# Altium project PCB_Project.PrjPcb (part 2 of 2)

## Sheet lcd_ex.SchDoc
size A4
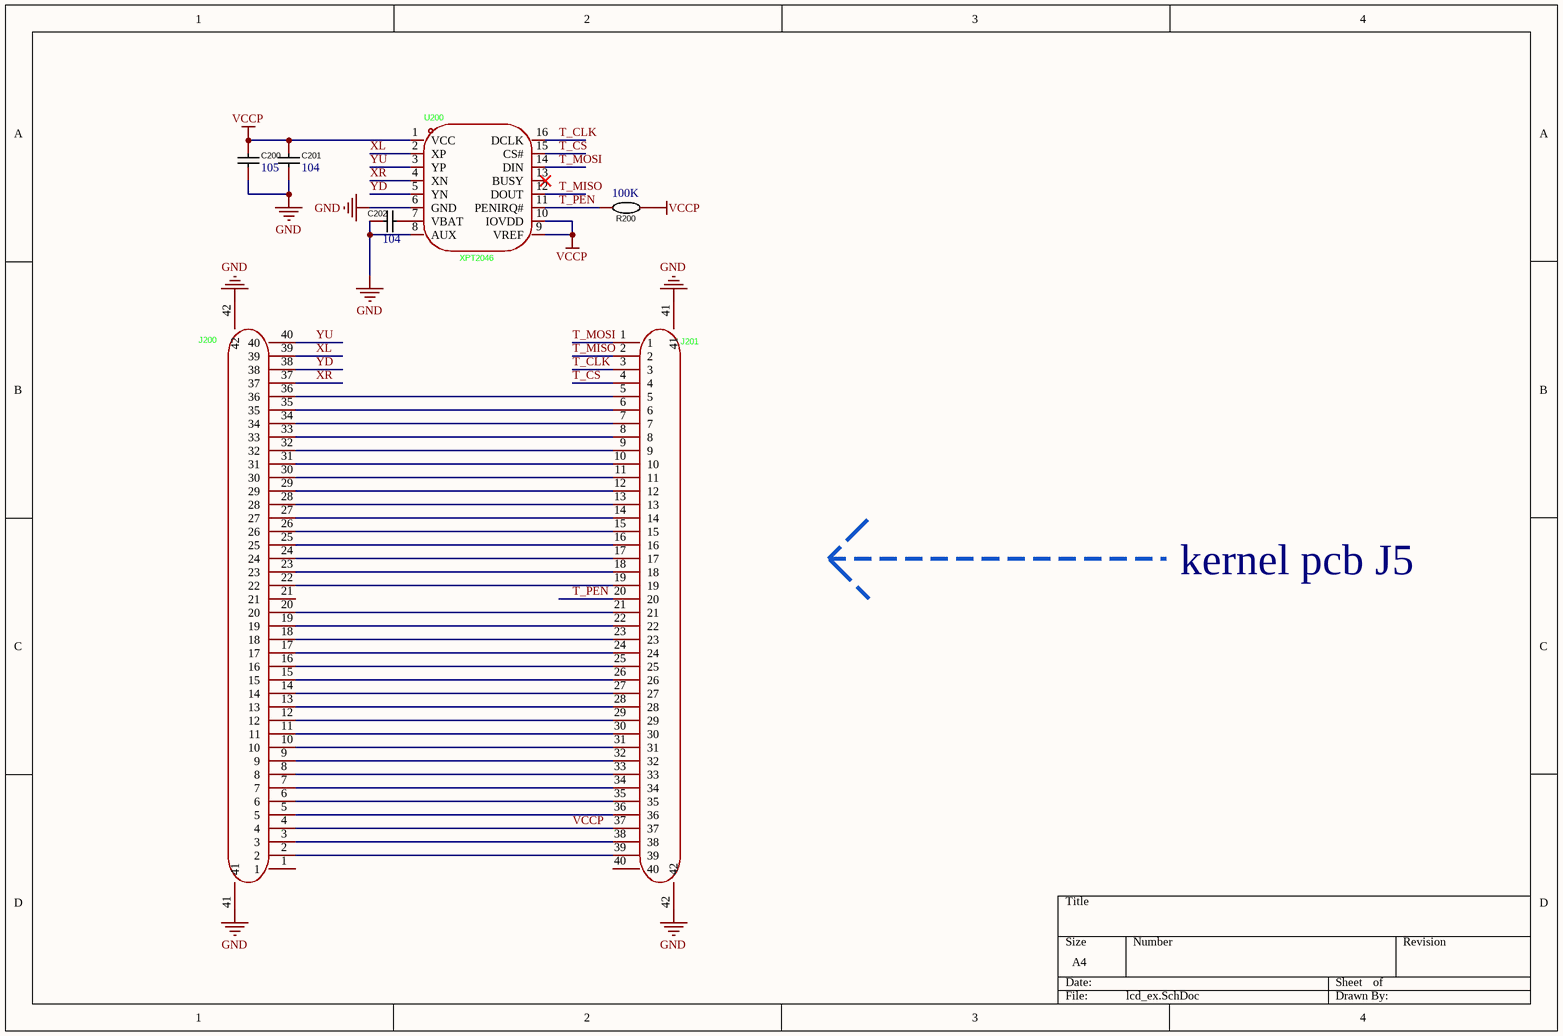
[diagram p5: lcd_ex.SchDoc]

### Parts
C200  105  [0805_C]
C201  104  [0805_C]
C202  104  [0805_C]
J200  AFC01-S40FCA-00  [FPC-SMD_AFC01-S40FCA-00]  (value not drawn)
J201  AFC01-S40FCA-00  [FPC-SMD_AFC01-S40FCA-00]  (value not drawn)
R200  100K  [0805_R]
U200  XPT2046  [TSSOP-16_L5.0-W4.4-P0.65-LS6.4-BL]

### Nets
GND: C200.1 C201.1 C202.2 J200.41 J200.42 J201.41 J201.42 U200.6(GND) U200.8(AUX)
VCCP: C200.2 C201.2 J200.4 J201.37 R200.2 U200.1(VCC) U200.9(VREF) U200.10(IOVDD)
T_CLK: J201.3 U200.16(DCLK)
T_CS: J201.4 U200.15(CS#)
T_MISO: J201.2 U200.12(DOUT)
T_MOSI: J201.1 U200.14(DIN)
T_PEN: J201.20 R200.1 U200.11(PENIRQ#)
XL: J200.39 U200.2(XP)
XR: J200.37 U200.4(XN)
YD: J200.38 U200.5(YN)
YU: J200.40 U200.3(YP)
NetC202_1: C202.1 U200.7(VBAT)
NetJ200_2: J200.2 J201.39
NetJ200_3: J200.3 J201.38
NetJ200_5: J200.5 J201.36
NetJ200_6: J200.6 J201.35
NetJ200_7: J200.7 J201.34
NetJ200_8: J200.8 J201.33
NetJ200_9: J200.9 J201.32
NetJ200_10: J200.10 J201.31
NetJ200_11: J200.11 J201.30
NetJ200_12: J200.12 J201.29
NetJ200_13: J200.13 J201.28
NetJ200_14: J200.14 J201.27
NetJ200_15: J200.15 J201.26
NetJ200_16: J200.16 J201.25
NetJ200_17: J200.17 J201.24
NetJ200_18: J200.18 J201.23
NetJ200_19: J200.19 J201.22
NetJ200_20: J200.20 J201.21
NetJ200_22: J200.22 J201.19
NetJ200_23: J200.23 J201.18
NetJ200_24: J200.24 J201.17
NetJ200_25: J200.25 J201.16
NetJ200_26: J200.26 J201.15
NetJ200_27: J200.27 J201.14
NetJ200_28: J200.28 J201.13
NetJ200_29: J200.29 J201.12
NetJ200_30: J200.30 J201.11
NetJ200_31: J200.31 J201.10
NetJ200_32: J200.32 J201.9
NetJ200_33: J200.33 J201.8
NetJ200_34: J200.34 J201.7
NetJ200_35: J200.35 J201.6
NetJ200_36: J200.36 J201.5

Not connected (* = marked no-connect by the designer): J200 1 21; J201 40; U200 13(BUSY)*

### Notes on the sheet
- kernel pcb J5

### Library data of the parts
C200-C202 = 0402C_104: 电容100nf; Manufacturer: FH(风华); Name: 20pF; Symbol: 0402CG200J500NT; Add into BOM: yes; Value: 20pF; Tolerance: ±5%; Voltage Rated: 50V; Temperature Coefficient: C0G; Device: 0402CG200J500NT; LCSC Part Name: 20pF ±5% 50V; Supplier Part: C1554; Manufacturer Part: 0402CG200J500NT; Supplier Footprint: 0402; JLCPCB Part Class: Basic Part; Datasheet: https://atta.szlcsc.com/upload/public/pdf/source/20170923/C1554_1506149268708988361.pdf; Supplier: LCSC; Convert to PCB: yes
J200 J201 = AFC01-S40FCA-00: FPC; Manufacturer: JS(钜硕电子); Add into BOM: yes; Locking Feature: 翻盖式; Number of Contacts: 40P; Pitch: 0.5mm; FFC, FCB Thickness: 0.3mm; Symbol: AFC01-S40FCA-00; Device: AFC01-S40FCA-00; LCSC Part Name: 间距:0.5mm P数:40P 翻盖式 下接; Supplier Part: C262674; Manufacturer Part: AFC01-S40FCA-00; Supplier Footprint: SMD,P=0.5mm,卧贴; JLCPCB Part Class: Extended Part; Datasheet: https://item.szlcsc.com/datasheet/AFC01-S40FCA-00/253933.html; Supplier: LCSC; Convert to PCB: yes; Contact Type: 下接; Mounting Type: 卧贴; Height Above Board: 2mm
R200 = 0402WGF1003TCE: 电阻100K; Manufacturer: UNI-ROYAL(厚声); Name: 10kΩ; Symbol: 0402WGF1002TCE; Add into BOM: yes; Value: 10kΩ; Tolerance: ±1%; Power(Watts): 62.5mW; Temperature Coefficient: ±100ppm/℃; Overload Voltage (Max): 50V; Device: 0402WGF1002TCE; LCSC Part Name: 10kΩ ±1% 62.5mW; Supplier Part: C25744; Manufacturer Part: 0402WGF1002TCE; Supplier Footprint: 0402; JLCPCB Part Class: Basic Part; Datasheet: https://atta.szlcsc.com/upload/public/pdf/source/20200306/C422600_1E6D84923E4A46A82E41ADD87F860B5C.pdf; Supplier: LCSC; Convert to PCB: yes; Type: 厚膜电阻; Operating Temperature Range: -55℃~+155℃
U200 = XPT2046: Manufacturer: XPT(矽普特); Add into BOM: yes; Symbol: XPT2046; Device: XPT2046; LCSC Part Name: XPT2046; Supplier Part: C19076; Manufacturer Part: XPT2046; Supplier Footprint: TSSOP-16; JLCPCB Part Class: Extended Part; Datasheet: https://item.szlcsc.com/datasheet/XPT2046/19779.html; Supplier: LCSC; Convert to PCB: yes; Touch Screen Type: -; Interface: -

## Sheet lcd_ex_cap_touch.SchDoc
size A4
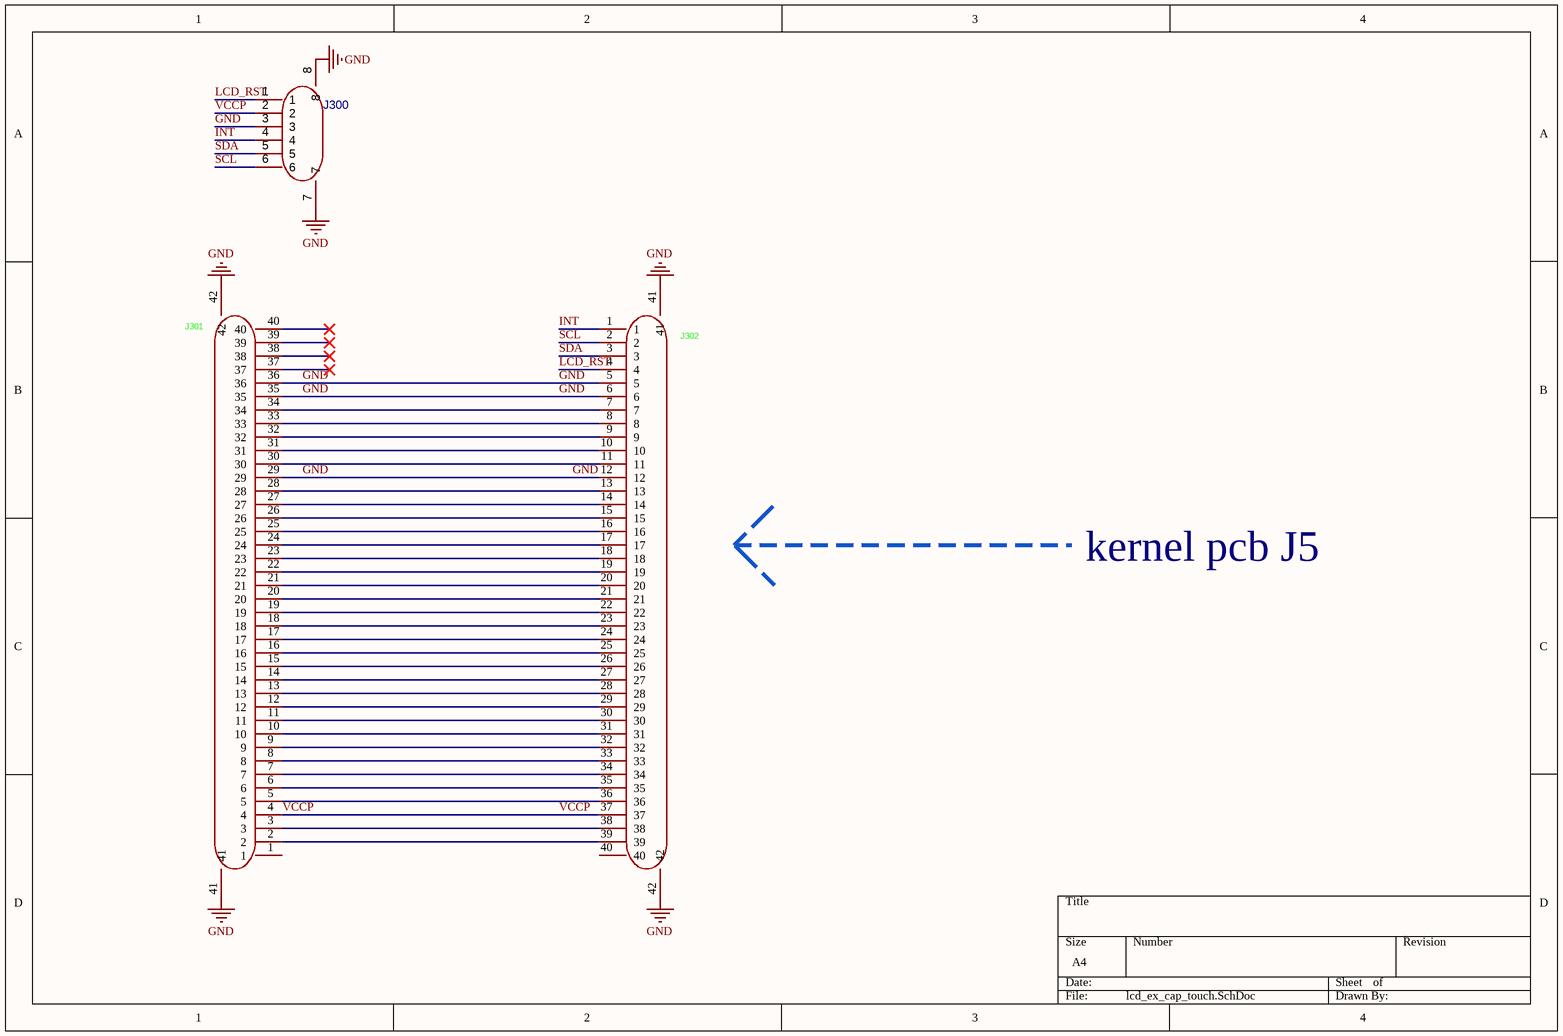
[diagram p6: lcd_ex_cap_touch.SchDoc]

### Parts
J300  (no value)  [FPC-SMD_P0.50-6P_QCHF-SM-H2.0_1]
J301  AFC01-S40FCA-00  [FPC-SMD_AFC01-S40FCA-00]  (value not drawn)
J302  AFC01-S40FCA-00  [FPC-SMD_AFC01-S40FCA-00]  (value not drawn)

### Nets
GND: J300.3 J300.7 J300.8 J301.29 J301.35 J301.36 J301.41 J301.42 J302.5 J302.6 J302.12 J302.41 J302.42
VCCP: J300.2 J301.4 J302.37
INT: J300.4 J302.1
LCD_RST: J300.1 J302.4
SCL: J300.6 J302.2
SDA: J300.5 J302.3
NetJ301_2: J301.2 J302.39
NetJ301_3: J301.3 J302.38
NetJ301_5: J301.5 J302.36
NetJ301_6: J301.6 J302.35
NetJ301_7: J301.7 J302.34
NetJ301_8: J301.8 J302.33
NetJ301_9: J301.9 J302.32
NetJ301_10: J301.10 J302.31
NetJ301_11: J301.11 J302.30
NetJ301_12: J301.12 J302.29
NetJ301_13: J301.13 J302.28
NetJ301_14: J301.14 J302.27
NetJ301_15: J301.15 J302.26
NetJ301_16: J301.16 J302.25
NetJ301_17: J301.17 J302.24
NetJ301_18: J301.18 J302.23
NetJ301_19: J301.19 J302.22
NetJ301_20: J301.20 J302.21
NetJ301_21: J301.21 J302.20
NetJ301_22: J301.22 J302.19
NetJ301_23: J301.23 J302.18
NetJ301_24: J301.24 J302.17
NetJ301_25: J301.25 J302.16
NetJ301_26: J301.26 J302.15
NetJ301_27: J301.27 J302.14
NetJ301_28: J301.28 J302.13
NetJ301_30: J301.30 J302.11
NetJ301_31: J301.31 J302.10
NetJ301_32: J301.32 J302.9
NetJ301_33: J301.33 J302.8
NetJ301_34: J301.34 J302.7

Not connected (* = marked no-connect by the designer): J301 1 37* 38* 39* 40*; J302 40

### Notes on the sheet
- kernel pcb J5

### Library data of the parts
J300 = AFC24-S06FIA-00: Symbol: AFC24-S06FIA-00
J301 J302 = AFC01-S40FCA-00: as J200 on sheet lcd_ex; Symbol: AFC01-S40FCA-00; Device: AFC01-S40FCA-00; LCSC Part Name: 间距:0.5mm P数:40P 翻盖式 下接; Supplier Part: C262674; Manufacturer Part: AFC01-S40FCA-00; Supplier Footprint: SMD,P=0.5mm,卧贴; JLCPCB Part Class: Extended Part; Datasheet: https://item.szlcsc.com/datasheet/AFC01-S40FCA-00/253933.html; Supplier: LCSC; Convert to PCB: yes; Contact Type: 下接; Mounting Type: 卧贴; Height Above Board: 2mm

## Nets that join several sheets
GND: kernel (132 pins), kernel_RJ45 (8 pins), lcd_ex (9 pins), lcd_ex_cap_touch (13 pins)
SGND: kernel (M1.1 USB1.7), kernel_RJ45 (J101.8 J101.SH1 J101.SH2)
VCCP: kernel (19 pins), lcd_ex (8 pins), lcd_ex_cap_touch (J300.2 J301.4 J302.37)
LCD_RST: kernel (J5.37 U8.164), lcd_ex_cap_touch (J300.1 J302.4)
SCL: kernel (J5.39 U8.167), lcd_ex_cap_touch (J300.6 J302.2)
SDA: kernel (J5.38 U8.165), lcd_ex_cap_touch (J300.5 J302.3)
TPRX_N: kernel (J2.4 R17.1 U2.22), kernel_RJ45 (J100.4 J101.6)
TPRX_P: kernel (J2.8 R14.1 U2.23), kernel_RJ45 (J100.8 J101.3)
TPTX_N: kernel (J2.9 R9.1 U2.20), kernel_RJ45 (J100.9 J101.2)
TPTX_P: kernel (J2.10 R7.1 U2.21), kernel_RJ45 (J100.10 J101.1)